# Altium project COMANDO.PrjPcb
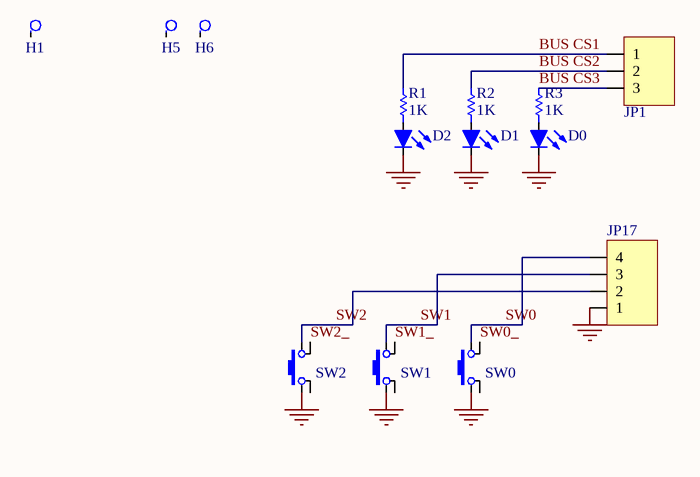
[diagram p0: COMANDO.SchDoc]
1 sheet, 14 parts. Net scope: global (net labels, ports and power ports of the same name join across sheets).
Board file: BOTONES LARGO.PcbDoc

## Sheet COMANDO.SchDoc
size A

### Parts
D0  Led 5mm Rojo Difuso  [LED5mm ROJO]  (value not drawn)
D1  Led 5mm Rojo Difuso  [LED5mm ROJO]  (value not drawn)
D2  Led 5mm Rojo Difuso  [LED5mm ROJO]  (value not drawn)
H1  Agujero de Montaje  [agujero]  (value not drawn)  (no BOM)
H5  Agujero de Montaje  [agujero]  (value not drawn)  (no BOM)
H6  Agujero de Montaje  [agujero]  (value not drawn)  (no BOM)
JP1  Header3x1  [CONPOL3X1_90]  (value not drawn)
JP17  Header4x1  [CONPOL4x1_90]  (value not drawn)
R1  value 1K  [1206NP]  (hidden comment: Res)
R2  value 1K  [1206NP]  (hidden comment: Res)
R3  value 1K  [1206NP]  (hidden comment: Res)
SW0  SW_T_5MM  [SW_T_5MM]  (value not drawn)
SW1  SW_T_5MM  [SW_T_5MM]  (value not drawn)
SW2  SW_T_5MM  [SW_T_5MM]  (value not drawn)

### Nets
GND: D0.2(K) D1.2(K) D2.2(K) JP17.1 SW0.3 SW1.3 SW2.3
BUS CS1: JP1.1 R1.2
BUS CS2: JP1.2 R2.2
BUS CS3: JP1.3 R3.2
SW0: JP17.4 SW0.4
SW0_: SW0.2
SW1: JP17.3 SW1.4
SW1_: SW1.2
SW2: JP17.2 SW2.4
SW2_: SW2.2
NetD0_1: D0.1(A) R3.1
NetD1_1: D1.1(A) R2.1
NetD2_1: D2.1(A) R1.1

Not connected (* = marked no-connect by the designer): H1 1; H5 1; H6 1; SW0 1; SW1 1; SW2 1

### Library data of the parts
D0-D2 = Led 5mm Rojo Difuso: Codigo Ebay: NA; Dolares Ebay: 0.06
JP1 = Header3x1: Header 3x1; Price: ?
JP17 = Header4x1: Header 4x1; Price: SW1 SW2
R1-R3 = Res: Resistor; Power: 0.25W; Price: 0.036
SW0-SW2 = SW_T_5MM: Price: ?